# Altium schematic sheet LVDS_UART.SchDoc: LVDS UART
size A; Author: James Thomas; CompanyName: BYUI; DrawnBy: James Thomas; Engineer: James Thomas; Organization: CSEE; DocumentNumber: 2; Revision: 0.0.1; SheetNumber: 2; SheetTotal: 15
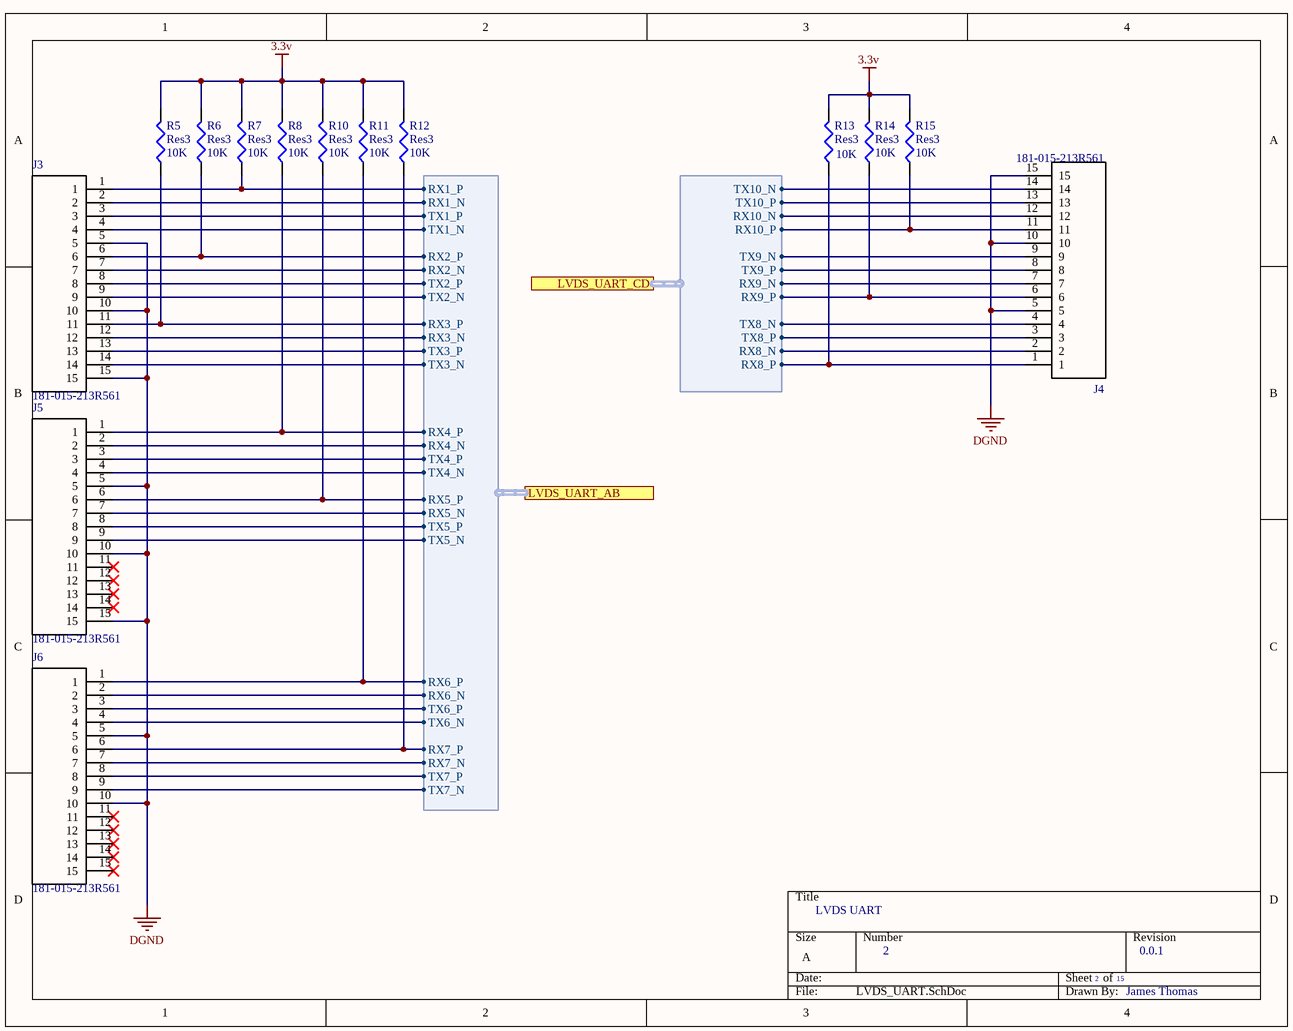
[diagram p0: LVDS_UART.SchDoc]

## Parts
J3  181-015-213R561  [*NORCOMP_181-015-213R561]
J4  181-015-213R561  [*NORCOMP_181-015-213R561]
J5  181-015-213R561  [*NORCOMP_181-015-213R561]
J6  181-015-213R561  [*NORCOMP_181-015-213R561]
R5  Res3  value 10K  [J1-0603]
R6  Res3  value 10K  [J1-0603]
R7  Res3  value 10K  [J1-0603]
R8  Res3  value 10K  [J1-0603]
R10  Res3  value 10K  [J1-0603]
R11  Res3  value 10K  [J1-0603]
R12  Res3  value 10K  [J1-0603]
R13  Res3  value 10K  [J1-0603]
R14  Res3  value 10K  [J1-0603]
R15  Res3  value 10K  [J1-0603]

## Ports
LVDS_UART_AB (harness LVDS_UART_AB), LVDS_UART_CD (harness LVDS_UART_CD)

## Harnesses
LVDS_UART_AB: RX1_P, RX1_N, TX1_P, TX1_N, RX2_P, RX2_N, TX2_P, TX2_N, RX3_P, RX3_N, TX3_P, TX3_N, RX4_P, RX4_N, TX4_P, TX4_N, RX5_P, RX5_N, TX5_P, TX5_N, RX6_P, RX6_N, TX6_P, TX6_N, RX7_P, RX7_N, TX7_P, TX7_N
LVDS_UART_CD: RX8_P, RX8_N, TX8_P, TX8_N, RX9_P, RX9_N, TX9_P, TX9_N, RX10_P, RX10_N, TX10_P, TX10_N

## Nets
3.3v: R5.2 R6.2 R7.2 R8.2 R10.2 R11.2 R12.2 R13.2 R14.2 R15.2
DGND: J3.5 J3.10 J3.15 J4.5 J4.10 J4.15 J5.5 J5.10 J5.15 J6.5 J6.10
NetJ3_1: J3.1 R7.1 ; port LVDS_UART_AB.RX1_P
NetJ3_2: J3.2 ; port LVDS_UART_AB.RX1_N
NetJ3_3: J3.3 ; port LVDS_UART_AB.TX1_P
NetJ3_4: J3.4 ; port LVDS_UART_AB.TX1_N
NetJ3_6: J3.6 R6.1 ; port LVDS_UART_AB.RX2_P
NetJ3_7: J3.7 ; port LVDS_UART_AB.RX2_N
NetJ3_8: J3.8 ; port LVDS_UART_AB.TX2_P
NetJ3_9: J3.9 ; port LVDS_UART_AB.TX2_N
NetJ3_11: J3.11 R5.1 ; port LVDS_UART_AB.RX3_P
NetJ3_12: J3.12 ; port LVDS_UART_AB.RX3_N
NetJ3_13: J3.13 ; port LVDS_UART_AB.TX3_P
NetJ3_14: J3.14 ; port LVDS_UART_AB.TX3_N
NetJ4_1: J4.1 R13.1 ; port LVDS_UART_CD.RX8_P
NetJ4_2: J4.2 ; port LVDS_UART_CD.RX8_N
NetJ4_3: J4.3 ; port LVDS_UART_CD.TX8_P
NetJ4_4: J4.4 ; port LVDS_UART_CD.TX8_N
NetJ4_6: J4.6 R14.1 ; port LVDS_UART_CD.RX9_P
NetJ4_7: J4.7 ; port LVDS_UART_CD.RX9_N
NetJ4_8: J4.8 ; port LVDS_UART_CD.TX9_P
NetJ4_9: J4.9 ; port LVDS_UART_CD.TX9_N
NetJ4_11: J4.11 R15.1 ; port LVDS_UART_CD.RX10_P
NetJ4_12: J4.12 ; port LVDS_UART_CD.RX10_N
NetJ4_13: J4.13 ; port LVDS_UART_CD.TX10_P
NetJ4_14: J4.14 ; port LVDS_UART_CD.TX10_N
NetJ5_1: J5.1 R8.1 ; port LVDS_UART_AB.RX4_P
NetJ5_2: J5.2 ; port LVDS_UART_AB.RX4_N
NetJ5_3: J5.3 ; port LVDS_UART_AB.TX4_P
NetJ5_4: J5.4 ; port LVDS_UART_AB.TX4_N
NetJ5_6: J5.6 R10.1 ; port LVDS_UART_AB.RX5_P
NetJ5_7: J5.7 ; port LVDS_UART_AB.RX5_N
NetJ5_8: J5.8 ; port LVDS_UART_AB.TX5_P
NetJ5_9: J5.9 ; port LVDS_UART_AB.TX5_N
NetJ6_1: J6.1 R11.1 ; port LVDS_UART_AB.RX6_P
NetJ6_2: J6.2 ; port LVDS_UART_AB.RX6_N
NetJ6_3: J6.3 ; port LVDS_UART_AB.TX6_P
NetJ6_4: J6.4 ; port LVDS_UART_AB.TX6_N
NetJ6_6: J6.6 R12.1 ; port LVDS_UART_AB.RX7_P
NetJ6_7: J6.7 ; port LVDS_UART_AB.RX7_N
NetJ6_8: J6.8 ; port LVDS_UART_AB.TX7_P
NetJ6_9: J6.9 ; port LVDS_UART_AB.TX7_N

Not connected (* = marked no-connect by the designer): J5 11* 12* 13* 14*; J6 11* 12* 13* 14* 15*

## Library data of the parts
J3-J6 = 181-015-213R561: 15 Position D-Sub, High Density Receptacle, Female Sockets Connector; MF: NorComp Inc.; Availability: Unavailable; Price: None; MP: 181-015-213R561; Package: None; SnapEDA_Link: https://www.snapeda.com/parts/181-015-213R561/NorComp%20Inc./view-part/560830/?ref=snap; Value: *
R5-R8 R10-R15 = Res3: Resistor; Published: 8-Jun-2000; LatestRevisionDate: 29-May-2009; LatestRevisionNote: IPC-7351 Footprint Added.; PackageReference: J1-0603; Publisher: Altium Limited; PackageDescription: Chip Resistor